# Altium schematic sheet GPS_Module.SchDoc: Lab. Proj. PCB
size A4; Author: Tomasz Machnik; Revision: 1; SheetNumber: 7; SheetTotal: 7
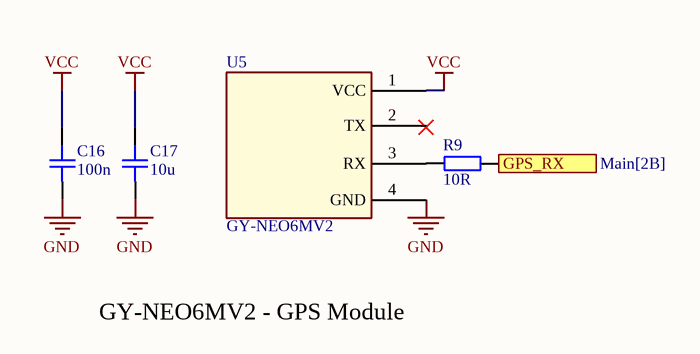
[diagram p0: GPS_Module.SchDoc]

## Parts
C16  100n  [CAP_0805]
C17  10u  [CAP_0805]
R9  10R  [RES_0805]
U5  GY-NEO6MV2  [GY-NEO6MV]

## Ports
GPS_RX (out, see Main[2B])

## Nets
GND: C16.1 C17.1 U5.4(GND)
VCC: C16.2 C17.2 U5.1(VCC)
GPS_RX: R9.2 ; port GPS_RX
NetR9_1: R9.1 U5.3(RX)

Not connected (* = marked no-connect by the designer): U5 2(TX)

## Notes on the sheet
- GY-NEO6MV2 - GPS Module
- Title:
- Author:
- Approved:
- Size:
- Date:
- Git Hash:
- A4
- Prj:
- SW Version:
- Variant:
- Edited:
- CONFIDENTIAL
- File:

## Library data of the parts
C16 C17 = CAP_0805: Capacitor SMD 0805; Manufacturer: *; Manufacturer Part Number: *; Distributor Link: *; LCSC: *; Rating: *; Dielectric: *
R9 = RES_0805: Resistor SMD 0805; Manufacturer: *; Manufacturer Part Number: *; Distributor Link: *; LCSC: *